# Altium project Bench_PSU_Main_Board.PrjPcb
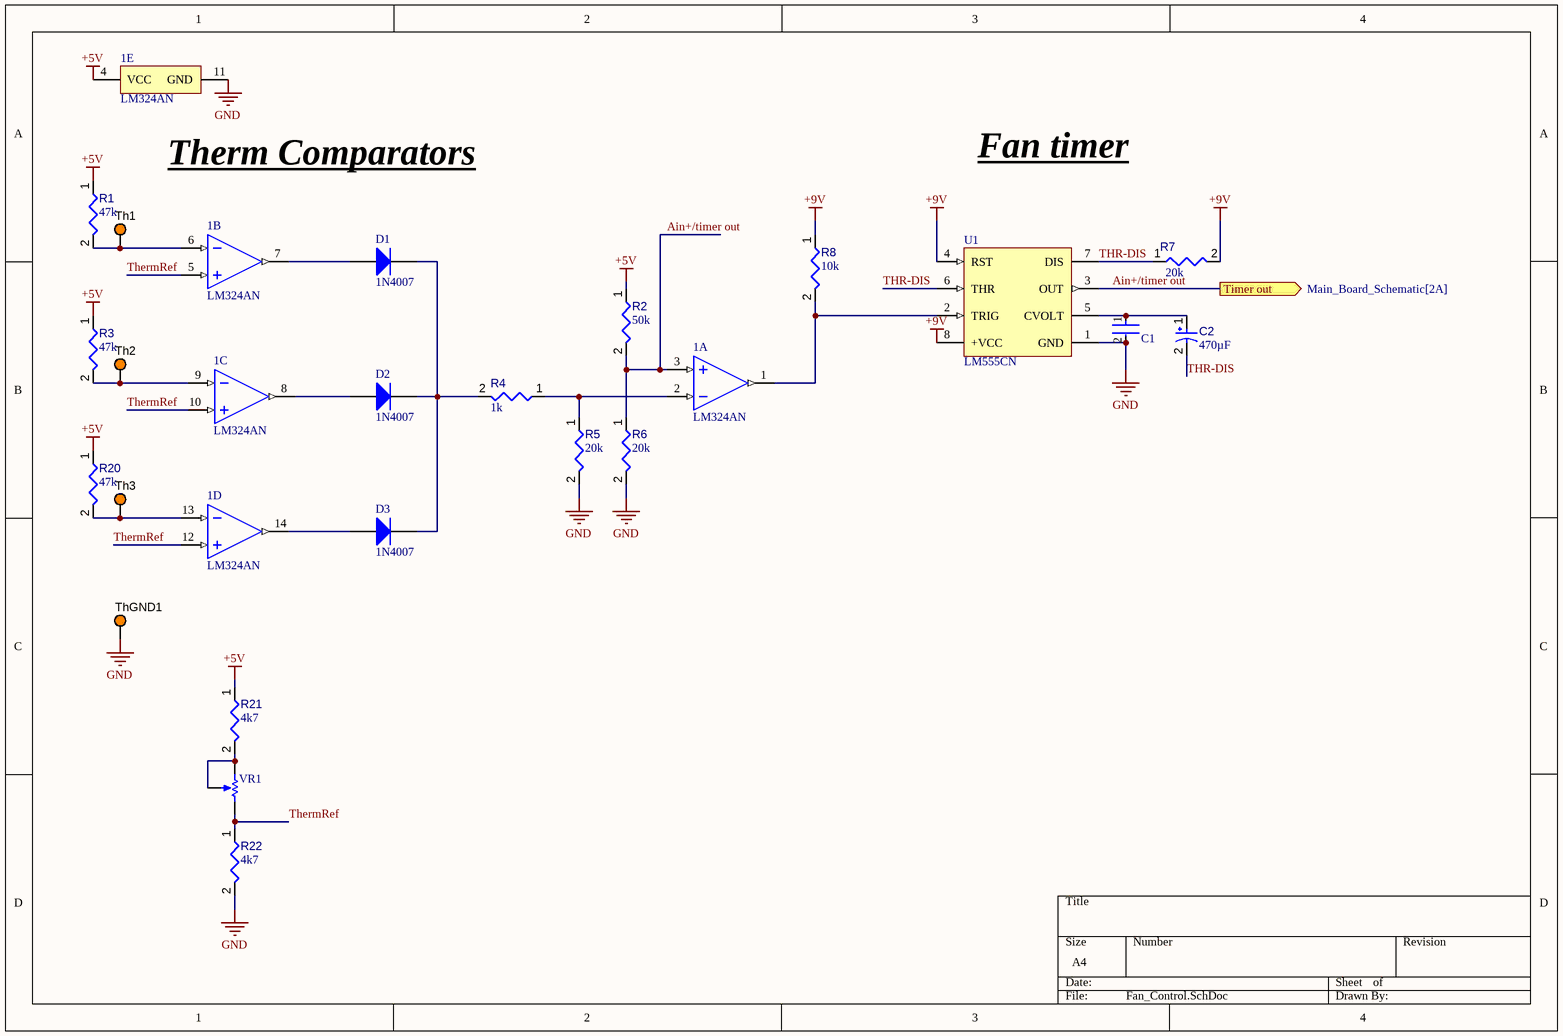
[diagram p0: Fan_Control.SchDoc]
7 sheets, 76 parts. Net scope: hierarchical (ports join the sheet entries above them; power ports are global).
Board files: Control_Board.PcbDoc, Current_Control.PcbDoc, Voltage_Controll.PcbDoc
Sheets:
  Fan_Control.SchDoc
  Relay_Latches.SchDoc
  Relays.SchDoc
  Power_Supply.SchDoc
    U_Voltage_Control = Voltage_Control.SchDoc
    U_Current_Limit = Current_Limit.SchDoc
    U_Power = Power.SchDoc

## Sheet Fan_Control.SchDoc
size A4; SheetNumber: 6; SheetTotal: 7

### Parts
1  LM324AN  [TI-N0014A]  (parts A,B,C,D,E of 5)
C1  RCER71H103K0K1H03B  [FP-RCE0K1-MFG]  (value not drawn)
C2  value 470µF  [CAPPR65-350-1150X800X1250]  (hidden comment: ECA1HM101)
D1  1N4007  [FAIR-DO-41-2]
D2  1N4007  [FAIR-DO-41-2]
D3  1N4007  [FAIR-DO-41-2]
R1  value 47k  [RESA60-630X240]  (hidden comment: MFR-25FBF52-100R)
R2  value 50k  [RESA60-630X240]  (hidden comment: MFR-25FBF52-100R)
R3  value 47k  [RESA60-630X240]  (hidden comment: MFR-25FBF52-100R)
R4  value 1k  [RESA60-630X240]  (hidden comment: MFR-25FBF52-100R)
R5  value 20k  [RESA60-630X240]  (hidden comment: MFR-25FBF52-100R)
R6  value 20k  [RESA60-630X240]  (hidden comment: MFR-25FBF52-100R)
R7  value 20k  [RESA60-630X240]  (hidden comment: MFR-25FBF52-1K)
R8  value 10k  [RESA60-630X240]  (hidden comment: MFR-25FBF52-1K)
R20  value 47k  [RESA60-630X240]  (hidden comment: MFR-25FBF52-100R)
R21  value 4k7  [RESA60-630X240]  (hidden comment: MFR-25FBF52-100R)
R22  value 4k7  [RESA60-630X240]  (hidden comment: MFR-25FBF52-100R)
Th1  5003  [KSTN-5003]  (value not drawn)
Th2  5003  [KSTN-5003]  (value not drawn)
Th3  5003  [KSTN-5003]  (value not drawn)
ThGND1  5003  [KSTN-5003]  (value not drawn)
U1  LM555CN  [N08E]
VR1  3362P-1-104LF  [BOUR-3362P]  (value not drawn)

### Ports
Timer out (out, see Main_Board_Schematic[2A])

### Nets
+5V: 1.4(VCC) R1.1 R2.1 R3.1 R20.1 R21.1
+9V: R7.2 R8.1 U1.4(RST) U1.8(+VCC)
GND: 1.11(GND) C1.2 R5.2 R6.2 R22.2 ThGND1.1 U1.1(GND)
Ain+/timer out: 1.3(1IN+) R2.2 R6.1 U1.3(OUT) ; port Timer out
ThermRef: 1.5(2IN+) 1.10(3IN+) 1.12(4IN+) R22.1 VR1.3(CW)
THR-DIS: C2.2 R7.1 U1.6(THR) U1.7(DIS)
Net1_1: 1.1(1OUT) R8.2 U1.2(TRIG)
Net1_2: 1.2(1IN-) R4.1 R5.1
Net1_6: 1.6(2IN-) R1.2 Th1.1
Net1_7: 1.7(2OUT) D1.2(A)
Net1_8: 1.8(3OUT) D2.2(A)
Net1_9: 1.9(3IN-) R3.2 Th2.1
Net1_13: 1.13(4IN-) R20.2 Th3.1
Net1_14: 1.14(4OUT) D3.2(A)
NetC1_1: C1.1 C2.1 U1.5(CVOLT)
NetD1_1: D1.1(K) D2.1(K) D3.1(K) R4.2
NetR21_2: R21.2 VR1.1(CCW) VR1.2(S)

### Notes on the sheet
- Therm Comparators
- Fan timer

### Library data of the parts
1 = CMP-014-00016-2: Quadruple Operational Amplifier, 1.2 MHz, 0 to 70 degC, 14-Pin PDIP (N), Pb-Free (RoHS), Tube; Manufacturer: Texas Instruments (TI); Max Dual Supply Voltage: 16V; Nominal Dual Supply Voltage: 12V; Nominal Voltage Gain: 100dB; Min Supply Voltage: 1.5V; Unity Gain Bandwidth Product: 1.2MHz; Output Current: 30mA; Nominal Supply Current: 3mA; RoHS Compliant: True; Package Reference: N-14; Min Operating Temperature: 0°C; Case/Package: DIP; Mounting Technology: TH; Package Description: 14-Pin Double In-line Package, Body 19.305 x 6.35 mm, Pitch 2.54 mm; Nominal Supply Voltage: 12V; Package URL: http://www.ti.com/lit/ml/mpdi002c/mpdi002c.pdf; Package Quantity: 25; Datasheet Version: SLOS066W, 03/2015; Manufacturer URL: http://www.ti.com/; Datasheet URL: http://www.ti.com/lit/ds/symlink/lm324a.pdf; Min Dual Supply Voltage: 1.5V; Max Supply Voltage: 16V; Pins: 14; Max Operating Temperature: 70°C
C1 = CMP-06035-044411-1: Cap Ceramic 10nF 50V X7R ±10% Radial 5mm +125°C Automotive Bulk; Lead/Base Style: Formed Leads; Lead Diameter: 0.5mm; Resistor Type: Ceramic; Mount: Through Hole; Capacitance: 10nF; Lead Pitch: 0.197inch; Package Quantity: 500; Dielectric: X7R; Lead Free: Lead Free; Min Operating Temperature: -55°C; Packaging: Bulk; Width: 0.098inch; Length: 0.142inch; Voltage Rating: 50V; Case/Package: Radial; Max Operating Temperature: 125°C; Ratings: AEC-Q200; Height - Seated (Max): 0.138inch; Height: 3.5mm; Termination: Radial; Voltage Rating (DC): 50V; Tolerance: 10%
C2 = CMP-001-00026-7: Aluminum Electrolytic Capacitor, 100 uF, +/- 20%, 50 V, -40 to 85 degC, 2-Pin THD, RoHS, Bulk; Manufacturer: Panasonic; Voltage Rating: 50V; Ripple Current: 250mA; Datasheet URL: https://industrial.panasonic.com/cdbs/www-data/pdf/RDF0000/ABA0000C1218.pdf; Lead Pitch: 3.5mm; Mounting Technology: TH; Package Description: 2-Pin Radial Lead, Dia 8 mm, Height 12.5 mm; Diameter: 8mm; Ripple Current (AC): 250mA; Manufacturer URL: http://www.panasonic.com/; Capacitor Type: Electrolytic; Max Operating Temperature: 85°C; Pins: 2; Min Operating Temperature: -40°C; Tolerance: 20%; Case/Package: Radial; Packaging: Bulk; Package Quantity: 200; Package Reference: CAPPR65-350-1150X800X1250; RoHS Compliant: True; Datasheet Version: Rev. 05, 10/2016
D1-D3 = CMP-004-00007-2: General Purpose Rectifier, 1.1 V, 1.0 A, -55 to 175 degC, 2-Pin DO-41, RoHS, Tape and Reel; Manufacturer: Fairchild; Peak Reverse Current: 5uA; Max Surge Current: 30A; Elements: 1; Forward Voltage: 1.1V; Package Version: Rev. 2, 09/2008; Forward Current: 1A; Package Quantity: 5000; Packaging: TapeandReel; Package URL: http://www.fairchildsemi.com/dwg/DO/DO41A.pdf; Manufacturer URL: https://www.fairchildsemi.com/; Package Reference: DO-41-2; Pins: 2; Min Operating Temperature: -55°C; Datasheet Version: Rev. 1.1.0, 11/2014; Max Operating Temperature: 175°C; RoHS Compliant: True; Case/Package: DO-41-2; Mounting Technology: TH; Package Description: 2-Pin Axial Lead, Dia 2.375 mm, Body Length 4.63 mm; Datasheet URL: https://www.fairchildsemi.com/datasheets/1N/1N4007.pdf
R1-R6 R20-R22 = CMP-009-00046-4: Axial Resistor, 100 Ohm, +/- 1%, 0.25 W, -55 to 155 degC, 2-Pin THD, RoHS, Bulk; Manufacturer: Yageo; Voltage Rating: 250V; Power: 250mW; Packaging: Bulk; Max Operating Temperature: 155°C; Mounting Technology: TH; Datasheet Version: Apr-13; Case/Package: Axial; RoHS Compliant: True; Package Description: 2-Pin Axial Lead, Dia 2.4 mm, Body Length 6.3 mm; Package Quantity: 200; Package Reference: MFR-25; Tolerance: 1%; Composition: CarbonFilm; Datasheet URL: http://www.yageo.com/documents/recent/Yageo%20LR_MFR_2013.pdf; Manufacturer URL: http://www.yageo.com/; Min Operating Temperature: -55°C
R7 R8 = CMP-009-00048-4: Axial Resistor, 1 KOhm, +/- 1%, 250 mW, -55 to 155 degC, 2-Pin THD, RoHS, Bulk; Manufacturer: Yageo; Voltage Rating: 250V; Power: 250mW; Min Operating Temperature: -55°C; Max Operating Temperature: 155°C; Tolerance: 1%; Package Reference: MFR-25; Composition: CarbonFilm; Mounting Technology: TH; Packaging: Bulk; Case/Package: Axial; Datasheet URL: http://www.yageo.com/documents/recent/Yageo%20LR_MFR_2013.pdf; Package Quantity: 200; Manufacturer URL: http://www.yageo.com/; Package Description: 2-Pin Axial Lead, Dia 2.4 mm, Body Length 6.3 mm; Datasheet Version: Apr-13; RoHS Compliant: True
Th1-Th3 ThGND1 = CMP-002-00037-2: Test Point, Orange, Height 4.6 mm, Tail Length 3 mm, 1-Pin THD, RoHS; Manufacturer: Keystone; Colour: Orange; Packaging: Bulk; Package Description: 1-Pin Through Hole Device, Dia 2.54 mm; Pins: 1; Package Reference: 5003; Datasheet Version: Jun-15; Case/Package: 5003; Mounting Technology: TH; Connector Type: TestPoint; Diameter: 2.54mm; Contact Material: Bronze; Datasheet URL: http://keyelco.com/userAssets/file/M65p56.pdf; Manufacturer URL: http://www.keyelco.com/; Package Quantity: 10; Contact Plating: Tin; RoHS Compliant: True
U1 = CMP-0056-00017-2: Timer, 8-pin MDIP; Manufacturer: National Semiconductor; CompType: Analog IC; PackageTopMarking: NSUZXYTTE#*LM*555CN; PowerWise: N; PackageReference: N08E; ComponentLink1Description: LM555 Datasheet; ComponentLink3URL: http://www.national.com/packaging/folders/n08e.html; ComponentLink1URL: http://www.national.com/ds/LM/LM555.pdf; ComponentLink2URL: http://www.national.com/pf/LM/LM555.html; PackageDescription: MDIP, .365 x .250 x .130in, 8 Lead, .100in Pitch; DatasheetVersion: Jul-2006; RevisionNote: Component URLs added; Code_JEDEC: MS-001-BA; PinCount: 8; ComponentLink3Description: N08E Package Page; PackageVersion: revG, May-2006; ComponentLink2Description: LM555 Web Page; RoHS: N
VR1 = CMP-009-00040-2: Square Trimpot(R) Trimming Potentiometer, 100 KOhm, 300 V, -55 to 125 degC, 3-Pin THD, RoHS, Tube; Manufacturer: Bourns; Voltage Rating: 300V; Resistance: 100k; Power: 500mW; Tolerance: 10%; RoHS Compliant: True; Mounting Technology: TH; Datasheet URL: http://www.bourns.com/docs/Product-Datasheets/3362.pdf; Min Operating Temperature: -55°C; Composition: Potentiometer; Package Quantity: 250; Lead Pitch: 2.54mm; Case/Package: 3326P; Package Description: 3-Pin Through Hole Device, Body 6.6 x 6.99 mm, Pitch 2.54 mm; Datasheet Version: May-16; Packaging: Rail/Tube; Package Reference: 3326P; Manufacturer URL: http://www.bourns.com/; Max Operating Temperature: 125°C

## Sheet Relay_Latches.SchDoc
size A3; SheetNumber: 3; SheetTotal: 5
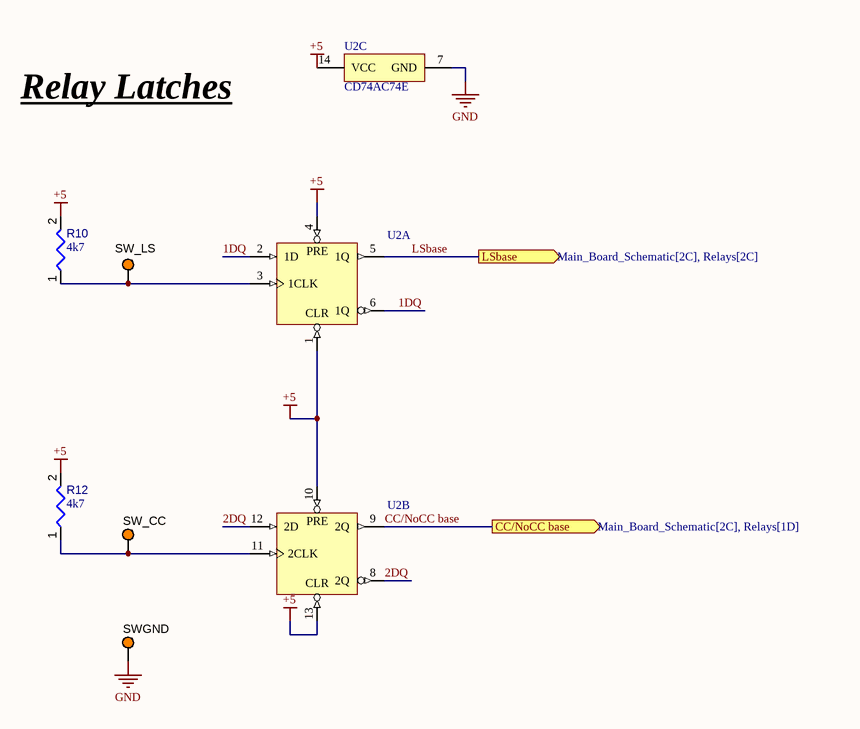
[diagram p1: Relay_Latches.SchDoc]

### Parts
R10  value 4k7  [RESA60-630X240]  (hidden comment: MFR-25FBF52-100R)
R12  value 4k7  [RESA60-630X240]  (hidden comment: MFR-25FBF52-100R)
SW_CC  5003  [KSTN-5003]  (value not drawn)
SW_LS  5003  [KSTN-5003]  (value not drawn)
SWGND  5003  [KSTN-5003]  (value not drawn)
U2  CD74AC74E  [N0014A]  (value not drawn)  (parts A,B,C of 3)

### Ports
CC/NoCC base (out, see Main_Board_Schematic[2C], Relays[1D]), LSbase (out, see Main_Board_Schematic[2C], Relays[2C])

### Nets
+5: R10.2 R12.2 U2.1(1~{CLR}) U2.4(1~{PRE}) U2.10(2~{PRE}) U2.13(2~{CLR}) U2.14(VCC)
GND: SWGND.1 U2.7(GND)
1DQ: U2.2(1D) U2.6(1Q)
2DQ: U2.8(2Q) U2.12(2D)
CC/NoCC base: U2.9(2Q) ; port CC/NoCC base
LSbase: U2.5(1Q) ; port LSbase
NetR10_1: R10.1 SW_LS.1 U2.3(1CLK)
NetR12_1: R12.1 SW_CC.1 U2.11(2CLK)

### Notes on the sheet
- Relay Latches
- (in symbol CMP-1619-00741-2, part A) PRE; CLR
- (in symbol CMP-1619-00741-2, part B) PRE; CLR

### Library data of the parts
R10 R12 = CMP-009-00046-4: as R1 on sheet Fan_Control; Packaging: Bulk; Max Operating Temperature: 155°C; Mounting Technology: TH; Datasheet Version: Apr-13; Case/Package: Axial; RoHS Compliant: True; Package Description: 2-Pin Axial Lead, Dia 2.4 mm, Body Length 6.3 mm; Package Quantity: 200; Package Reference: MFR-25; Tolerance: 1%; Composition: CarbonFilm; Datasheet URL: http://www.yageo.com/documents/recent/Yageo%20LR_MFR_2013.pdf; Manufacturer URL: http://www.yageo.com/; Min Operating Temperature: -55°C
SW_CC SW_LS SWGND = CMP-002-00037-2: as Th1 on sheet Fan_Control; Colour: Orange; Packaging: Bulk; Package Description: 1-Pin Through Hole Device, Dia 2.54 mm; Pins: 1; Package Reference: 5003; Datasheet Version: Jun-15; Case/Package: 5003; Mounting Technology: TH; Connector Type: TestPoint; Diameter: 2.54mm; Contact Material: Bronze; Datasheet URL: http://keyelco.com/userAssets/file/M65p56.pdf; Manufacturer URL: http://www.keyelco.com/; Package Quantity: 10; Contact Plating: Tin; RoHS Compliant: True
U2 = CMP-1619-00741-2: Dual Positive-Edge-Triggered D-Type Flip-Flops with Set and Reset, N0014A, TUBE; Manufacturer: Texas Instruments; VCC(Min)(V): 1.5; Rating: Catalog; Voltage(Nom)(V): 1.5,3.3,5; VCC(Max)(V): 5.5; Technology Family: AC; Input Type: CMOS; ICC @ Nom Voltage(Max)(mA): 0.04; Schmitt Trigger: No; F @ Nom Voltage(Max)(Mhz): 100; Output Drive (IOL/IOH)(Max)(mA): 24/-24; Output Logic: Inverted,Non-inverted; tpd @ Nom Voltage(Max)(ns): 114,12.7,9.1; Bits(#): 2; Generic Part Number: CD74AC74; Operating Temperature Range(C): -55 to 125; Code_JEDEC: MS-001; 3-State Output: No; PackageReference: N0014A; DatasheetVersion: SCHS231D; Output Type: CMOS

## Sheet Relays.SchDoc
size A4; SheetNumber: 6; SheetTotal: 8
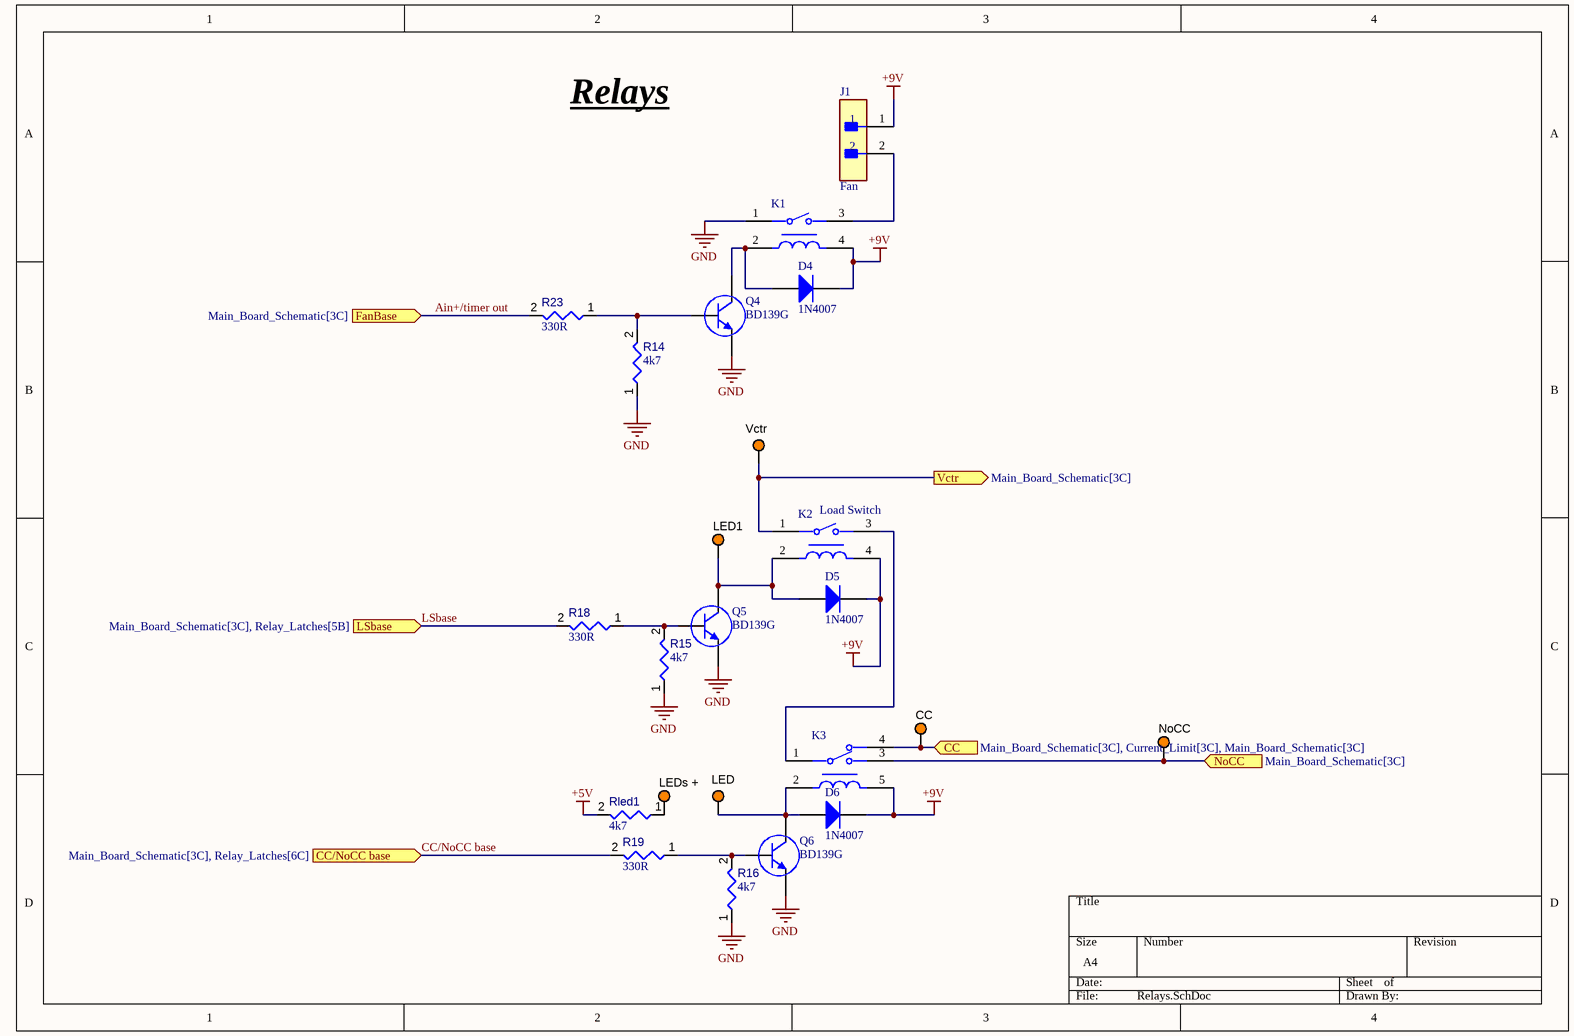
[diagram p2: Relays.SchDoc]

### Parts
CC  5003  [KSTN-5003]  (value not drawn)
D4  1N4007  [FAIR-DO-41-2]
D5  1N4007  [FAIR-DO-41-2]
D6  1N4007  [FAIR-DO-41-2]
J1  Fan  [FP-B2B-XH-A_LF_SN-MFG]
K1  LKQ1AF-5V-TV-5  [FP-LKQ1AF-5V-TV-5-MFG]  (value not drawn)
K2  Load Switch  [FP-LKQ1AF-5V-TV-5-MFG]
K3  G5LE-14-36 DC12  [FP-G5LE-14-36_DC12-MFG]  (value not drawn)
LED  5003  [KSTN-5003]  (value not drawn)
LED1  5003  [KSTN-5003]  (value not drawn)
LEDs_+  5003  [KSTN-5003]  (value not drawn)
NoCC  5003  [KSTN-5003]  (value not drawn)
Q4  BD139G  [FP-77-09-MFG]
Q5  BD139G  [FP-77-09-MFG]
Q6  BD139G  [FP-77-09-MFG]
R14  value 4k7  [RESA60-630X240]  (hidden comment: MFR-25FBF52-100R)
R15  value 4k7  [RESA60-630X240]  (hidden comment: MFR-25FBF52-100R)
R16  value 4k7  [RESA60-630X240]  (hidden comment: MFR-25FBF52-100R)
R18  value 330R  [RESA60-630X240]  (hidden comment: MFR-25FBF52-100R)
R19  value 330R  [RESA60-630X240]  (hidden comment: MFR-25FBF52-100R)
R23  value 330R  [RESA60-630X240]  (hidden comment: MFR-25FBF52-100R)
Rled1  value 4k7  [RESA60-630X240]  (hidden comment: MFR-25FBF52-100R)
Vctr  5003  [KSTN-5003]  (value not drawn)

### Ports
CC (in, see Main_Board_Schematic[3C], Current_Limit[3C], Main_Board_Schematic[3C]), CC/NoCC base (in, see Main_Board_Schematic[3C], Relay_Latches[6C]), FanBase (in, see Main_Board_Schematic[3C]), LSbase (in, see Main_Board_Schematic[3C], Relay_Latches[5B]), NoCC (in, see Main_Board_Schematic[3C]), Vctr (out, see Main_Board_Schematic[3C])

### Nets
+5V: Rled1.2
+9V: D4.1(K) D5.1(K) D6.1(K) J1.1 K1.4 K2.4 K3.5
GND: K1.1 Q4.1(E) Q5.1(E) Q6.1(E) R14.1 R15.1 R16.1
Ain+/timer out: R23.2 ; port FanBase
CC/NoCC base: R19.2 ; port CC/NoCC base
LSbase: R18.2 ; port LSbase
NetCC_1: CC.1 K3.4 ; port CC
NetD4_2: D4.2(A) K1.2 Q4.3(C)
NetD5_2: D5.2(A) K2.2 LED1.1 Q5.3(C)
NetD6_2: D6.2(A) K3.2 LED.1 Q6.3(C)
NetJ1_2: J1.2 K1.3
NetK2_1: K2.1 Vctr.1 ; port Vctr
NetK2_3: K2.3 K3.1
NetK3_3: K3.3 NoCC.1 ; port NoCC
NetLEDs_+_1: LEDs_+.1 Rled1.1
NetQ4_2: Q4.2(B) R14.2 R23.1
NetQ5_2: Q5.2(B) R15.2 R18.1
NetQ6_2: Q6.2(B) R16.2 R19.1

### Notes on the sheet
- Relays

### Library data of the parts
CC LED LED1 LEDs_+ NoCC Vctr = CMP-002-00037-2: as Th1 on sheet Fan_Control; Colour: Orange; Packaging: Bulk; Package Description: 1-Pin Through Hole Device, Dia 2.54 mm; Pins: 1; Package Reference: 5003; Datasheet Version: Jun-15; Case/Package: 5003; Mounting Technology: TH; Connector Type: TestPoint; Diameter: 2.54mm; Contact Material: Bronze; Datasheet URL: http://keyelco.com/userAssets/file/M65p56.pdf; Manufacturer URL: http://www.keyelco.com/; Package Quantity: 10; Contact Plating: Tin; RoHS Compliant: True
D4-D6 = CMP-004-00007-2: as D1 on sheet Fan_Control; Package Quantity: 5000; Packaging: TapeandReel; Package URL: http://www.fairchildsemi.com/dwg/DO/DO41A.pdf; Manufacturer URL: https://www.fairchildsemi.com/; Package Reference: DO-41-2; Pins: 2; Min Operating Temperature: -55°C; Datasheet Version: Rev. 1.1.0, 11/2014; Max Operating Temperature: 175°C; RoHS Compliant: True; Case/Package: DO-41-2; Mounting Technology: TH; Package Description: 2-Pin Axial Lead, Dia 2.375 mm, Body Length 4.63 mm; Datasheet URL: https://www.fairchildsemi.com/datasheets/1N/1N4007.pdf
J1 = CMP-2000-05888-3: CONN HEADER VERT 2POS 2.5MM; Current Rating: 3A; Voltage Rating: 250V; Number of Contacts: 2; Contact Resistance: 20mR; Wire/Cable Gauge: 22AWG; Insulation Resistance: 1GR; Connector Type: Male Pin; Packaging: Bulk; Contact Material: Brass; Lead Free: Lead Free; Orientation: Straight; Contact Plating: Tin; Max Current Rating: 3A; Termination: Solder; Fastening Type: Detent; Depth: 5.75mm; Housing Material: Polyamide; REACH SVHC: No SVHC; Series: XH; Voltage Rating (AC): 250V; Number of Positions: 2; Color: Natural; Contact Type: Male Pin; Max Voltage Rating (DC): 250V; Pitch: 2.5mm; Lead Pitch: 2.5mm; Mount: Through Hole; Max Operating Temperature: 85°C; Length: 7.4mm; Max Voltage Rating (AC): 250V; Min Operating Temperature: -25°C; Number of Rows: 1; Housing Color: White
K1 K2 = CMP-008-00006-1: Quiet Type, High Sensitivity 250MW, Slim Power Relay
K3 = CMP-08822-000072-1: RELAY GEN PURPOSE SPDT 10A 12V; Coil Resistance: 400R; Release Time: 5ms; Max Voltage Rating (DC): 125V; Coil Current: 30mA; Coil Power: 360mW; Relay Type: General Purpose; Coil Type: Non-Latching; Max Voltage Rating (AC): 250V; Operate Time: 10ms; Package Quantity: 100; Number of Pins: 5; Mount: Through Hole; Termination: PC Pin; Series: G5LE; Min Operating Temperature: -25°C; Max Operating Temperature: 85°C; Throw Configuration: SPDT; Coil Voltage (DC): 12V; Radiation Hardening: No; Contact Current Rating: 10A; Packaging: Tray; Contact Material: Tin
Q4-Q6 = CMP-013-00034-1: 1.5 A, 80 V NPN Power Bipolar Junction Transistor. ONSSPCTRNSTLT1T0R;; Case/Package: TO-225; Max Operating Temperature: 150°C; Pins: 3; Min Operating Temperature: -55°C
R14-R16 R18 R19 R23 Rled1 = CMP-009-00046-4: as R1 on sheet Fan_Control; Packaging: Bulk; Max Operating Temperature: 155°C; Mounting Technology: TH; Datasheet Version: Apr-13; Case/Package: Axial; RoHS Compliant: True; Package Description: 2-Pin Axial Lead, Dia 2.4 mm, Body Length 6.3 mm; Package Quantity: 200; Package Reference: MFR-25; Tolerance: 1%; Composition: CarbonFilm; Datasheet URL: http://www.yageo.com/documents/recent/Yageo%20LR_MFR_2013.pdf; Manufacturer URL: http://www.yageo.com/; Min Operating Temperature: -55°C

## Sheet Power_Supply.SchDoc
size A4; SheetNumber: 1; SheetTotal: 8
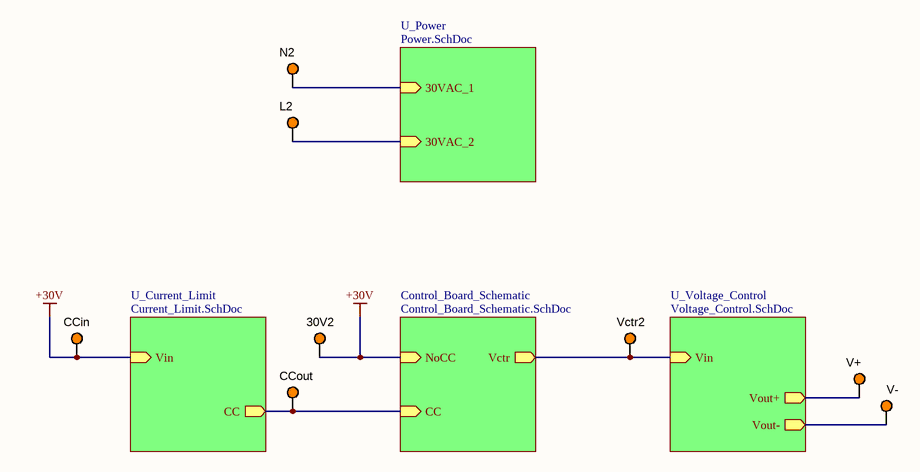
[diagram p3: Power_Supply.SchDoc]

### Parts
30V2  5003  [KSTN-5003]  (value not drawn)
CCin  5003  [KSTN-5003]  (value not drawn)
CCout  5003  [KSTN-5003]  (value not drawn)
L2  5003  [KSTN-5003]  (value not drawn)
N2  5003  [KSTN-5003]  (value not drawn)
V+  5003  [KSTN-5003]  (value not drawn)
V-  5003  [KSTN-5003]  (value not drawn)
Vctr2  5003  [KSTN-5003]  (value not drawn)

### Sub-sheets
Control_Board_Schematic = Control_Board_Schematic.SchDoc (file not in this document): Vctr (out), NoCC (in), CC (in)
U_Current_Limit = Current_Limit.SchDoc: Vin (in), CC (out)
U_Power = Power.SchDoc: 30VAC_1 (in), 30VAC_2 (in)
U_Voltage_Control = Voltage_Control.SchDoc: Vin (in), Vout+ (out), Vout- (out)

### Nets
+30V: 30V2.1 CCin.1 ; sheet Control_Board_Schematic/NoCC, sheet U_Current_Limit/Vin
Net*1_2: L2.1 ; sheet U_Power/30VAC_2
Net*1_3: N2.1 ; sheet U_Power/30VAC_1
NetCCout_1: CCout.1 ; sheet Control_Board_Schematic/CC, sheet U_Current_Limit/CC
NetD7_1: V+.1 ; sheet U_Voltage_Control/Vout+
NetD7_2: V-.1 ; sheet U_Voltage_Control/Vout-
NetU4_3: Vctr2.1 ; sheet Control_Board_Schematic/Vctr, sheet U_Voltage_Control/Vin

### Library data of the parts
30V2 CCin CCout L2 N2 V+ V- Vctr2 = CMP-002-00037-2: as Th1 on sheet Fan_Control; Colour: Orange; Packaging: Bulk; Package Description: 1-Pin Through Hole Device, Dia 2.54 mm; Pins: 1; Package Reference: 5003; Datasheet Version: Jun-15; Case/Package: 5003; Mounting Technology: TH; Connector Type: TestPoint; Diameter: 2.54mm; Contact Material: Bronze; Datasheet URL: http://keyelco.com/userAssets/file/M65p56.pdf; Manufacturer URL: http://www.keyelco.com/; Package Quantity: 10; Contact Plating: Tin; RoHS Compliant: True

## Sheet Voltage_Control.SchDoc
size A4; SheetNumber: 8; SheetTotal: 8
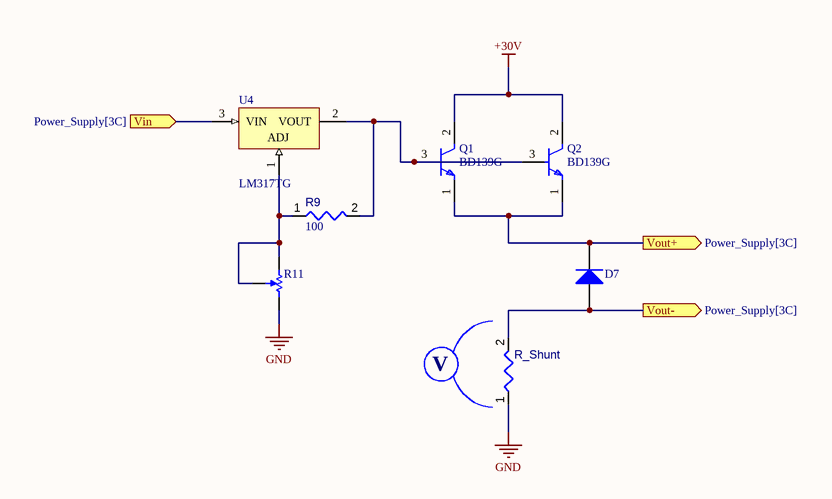
[diagram p4: Voltage_Control.SchDoc]

### Parts
D7  1N4007  [FAIR-DO-41-2]  (value not drawn)
Q1  BD139G  [FP-77-09-MFG]
Q2  BD139G  [FP-77-09-MFG]
R9  value 100  [RESA60-630X240]  (hidden comment: MFR-25FBF52-100R)
R11  3296W-1-102LF  [BOUR-3296W-1-3]  (value not drawn)
R_Shunt  MFR-25FBF52-100R  [RESA60-630X240]  (value not drawn)
U4  LM317TG  [ONSC-TO-220-3-221AB-01]

### Ports
Vin (in, see Power_Supply[3C]), Vout+ (out, see Power_Supply[3C]), Vout- (out, see Power_Supply[3C])

### Nets
+30V: Q1.2(C) Q2.2(C)
GND: R11.2(B) R_Shunt.1
NetD7_1: D7.1(K) Q1.1(E) Q2.1(E) ; port Vout+
NetD7_2: D7.2(A) R_Shunt.2 ; port Vout-
NetQ1_3: Q1.3(B) Q2.3(B) R9.2 U4.2(VOUT)
NetR9_1: R9.1 R11.1(A) R11.3(TAP) U4.1(ADJ)
NetU4_3: U4.3(VIN) ; port Vin

### Notes on the sheet
- V

### Library data of the parts
D7 = CMP-004-00007-2: as D1 on sheet Fan_Control; Package Quantity: 5000; Packaging: TapeandReel; Package URL: http://www.fairchildsemi.com/dwg/DO/DO41A.pdf; Manufacturer URL: https://www.fairchildsemi.com/; Package Reference: DO-41-2; Pins: 2; Min Operating Temperature: -55°C; Datasheet Version: Rev. 1.1.0, 11/2014; Max Operating Temperature: 175°C; RoHS Compliant: True; Case/Package: DO-41-2; Mounting Technology: TH; Package Description: 2-Pin Axial Lead, Dia 2.375 mm, Body Length 4.63 mm; Datasheet URL: https://www.fairchildsemi.com/datasheets/1N/1N4007.pdf
Q1 Q2 = CMP-013-00035-1: 1.5 A, 80 V NPN Power Bipolar Junction Transistor. ONSSPCTRNSTLT1T0R;; Pins: 3; Max Operating Temperature: 150°C; Case/Package: TO-225; Min Operating Temperature: -55°C; Mounting Technology: Through Hole
R9 = CMP-009-00046-5: Axial Resistor, 100 Ohm, +/- 1%, 0.25 W, -55 to 155 degC, 2-Pin THD, RoHS, Bulk; Manufacturer: Yageo; Power: 250mW; Voltage Rating: 250V; Tolerance: 1%; Packaging: Bulk; Max Operating Temperature: 155°C; Package Reference: MFR-25; Case/Package: Axial; Package Description: 2-Pin Axial Lead, Dia 2.4 mm, Body Length 6.3 mm; RoHS Compliant: True; Composition: CarbonFilm; Datasheet URL: http://www.yageo.com/documents/recent/Yageo%20LR_MFR_2013.pdf; Min Operating Temperature: -55°C; Package Quantity: 200; Mounting Technology: TH; Datasheet Version: Apr-13; Manufacturer URL: http://www.yageo.com/
R11 = CMP-009-00037-2: Square Trimpot(R) Trimming Potentiometer, 1000 Ohm, -55 to 125 degC, 3-Pin THD, RoHS, Tube; Manufacturer: Bourns; Power: 500mW; Tolerance: 10%; Voltage Rating: 300V; Resistance: 1k; Datasheet Version: May-16; Min Operating Temperature: -55°C; Max Operating Temperature: 150°C; Composition: Potentiometer; Package Description: 3-Pin Through Hole Device, Body 9.53 x 4.83 mm, Pitch 2.54 mm; Manufacturer URL: http://www.bourns.com/; Package Reference: 3296W-1-3; RoHS Compliant: True; Case/Package: 3296W-1-3; Packaging: Rail/Tube; Mounting Technology: TH; Package Quantity: 50; Datasheet URL: http://www.bourns.com/docs/Product-Datasheets/3296.pdf
R_Shunt = CMP-009-00046-5: Axial Resistor, 100 Ohm, +/- 1%, 0.25 W, -55 to 155 degC, 2-Pin THD, RoHS, Bulk; Manufacturer: Yageo; Power: 250mW; Voltage Rating: 250V; Value: 0.1; Tolerance: 1%; Packaging: Bulk; Max Operating Temperature: 155°C; Package Reference: MFR-25; Case/Package: Axial; Package Description: 2-Pin Axial Lead, Dia 2.4 mm, Body Length 6.3 mm; RoHS Compliant: True; Composition: CarbonFilm; Datasheet URL: http://www.yageo.com/documents/recent/Yageo%20LR_MFR_2013.pdf; Min Operating Temperature: -55°C; Package Quantity: 200; Mounting Technology: TH; Datasheet Version: Apr-13; Manufacturer URL: http://www.yageo.com/
U4 = CMP-019-00023-3: Adjustable Output, Positive Voltage Regulator, 1.5 A, 0 to 125 degC, 3-Pin TO-220 (221AB-01), Pb-Free, Rail; Manufacturer: ON Semiconductor; Outputs: 1; Max Input Voltage: 40V; Min Input Voltage: 4.2V; Output Current: 1.5A; Output Voltage: 1.2V; Package Version: Rev. A, 11/2010; Mounting Technology: TH; Case/Package: TO-220; Package Description: 3-Pin Flange Mount, Vertical Straight Lead, Body 9.97 x 4.445 mm, Pitch 2.54 mm; Package Reference: TO-220-3-221AB-01; Manufacturer URL: http://www.onsemi.com/; Package Quantity: 50; Datasheet Version: Rev. 14, 01/2016; Max Ouput Current: 1.5A; Min Operating Temperature: 0°C; Packaging: Rail/Tube; Datasheet URL: http://www.onsemi.com/pub_link/Collateral/LM317-D.PDF; Max Operating Temperature: 125°C; RoHS Compliant: True; Pins: 3

## Sheet Current_Limit.SchDoc
size A4; SheetNumber: 7; SheetTotal: 8
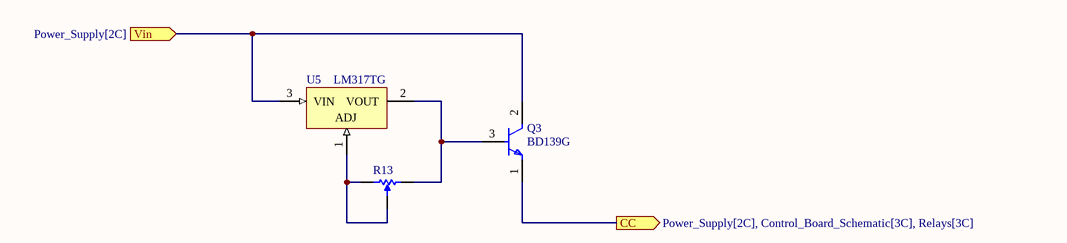
[diagram p5: Current_Limit.SchDoc]

### Parts
Q3  BD139G  [FP-77-09-MFG]
R13  3296W-1-102LF  [BOUR-3296W-1-3]  (value not drawn)
U5  LM317TG  [ONSC-TO-220-3-221AB-01]

### Ports
CC (out, see Power_Supply[2C], Control_Board_Schematic[3C], Relays[3C]), Vin (in, see Power_Supply[2C])

### Nets
+30V: Q3.2(C) U5.3(VIN) ; port Vin
NetCCout_1: Q3.1(E) ; port CC
NetQ3_3: Q3.3(B) R13.2(B) U5.2(VOUT)
NetR13_1: R13.1(A) R13.3(TAP) U5.1(ADJ)

### Library data of the parts
Q3 = CMP-013-00035-1: as Q1 on sheet Voltage_Control; Pins: 3; Max Operating Temperature: 150°C; Case/Package: TO-225; Min Operating Temperature: -55°C; Mounting Technology: Through Hole
R13 = CMP-009-00037-2: as R11 on sheet Voltage_Control; Datasheet Version: May-16; Min Operating Temperature: -55°C; Max Operating Temperature: 150°C; Composition: Potentiometer; Package Description: 3-Pin Through Hole Device, Body 9.53 x 4.83 mm, Pitch 2.54 mm; Manufacturer URL: http://www.bourns.com/; Package Reference: 3296W-1-3; RoHS Compliant: True; Case/Package: 3296W-1-3; Packaging: Rail/Tube; Mounting Technology: TH; Package Quantity: 50; Datasheet URL: http://www.bourns.com/docs/Product-Datasheets/3296.pdf
U5 = CMP-019-00023-3: as U4 on sheet Voltage_Control; Mounting Technology: TH; Case/Package: TO-220; Package Description: 3-Pin Flange Mount, Vertical Straight Lead, Body 9.97 x 4.445 mm, Pitch 2.54 mm; Package Reference: TO-220-3-221AB-01; Manufacturer URL: http://www.onsemi.com/; Package Quantity: 50; Datasheet Version: Rev. 14, 01/2016; Max Ouput Current: 1.5A; Min Operating Temperature: 0°C; Packaging: Rail/Tube; Datasheet URL: http://www.onsemi.com/pub_link/Collateral/LM317-D.PDF; Max Operating Temperature: 125°C; RoHS Compliant: True; Pins: 3

## Sheet Power.SchDoc
size A4; SheetNumber: 2; SheetTotal: 8
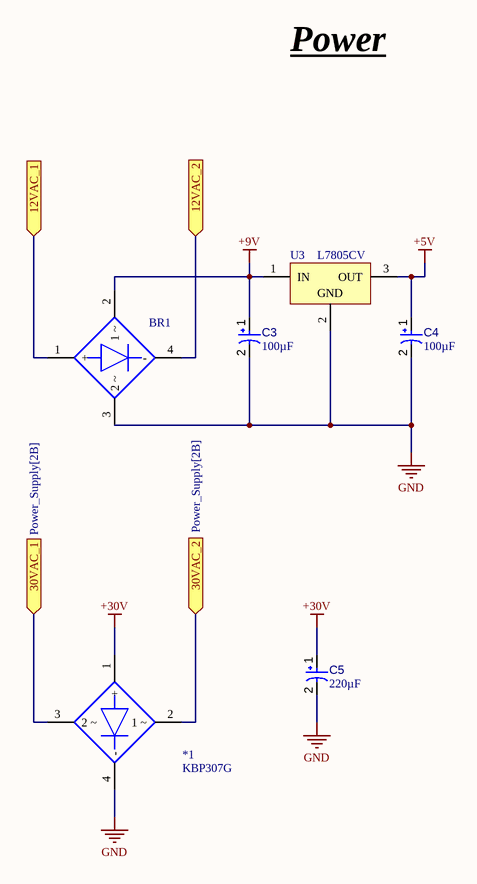
[diagram p6: Power.SchDoc]

### Parts
*1  KBP307G  [KBP4]
BR1  GBU8D  [FP-127EL-MFG]  (value not drawn)
C3  value 100µF  [CAPPR55-250-1120X630X1220]  (hidden comment: ECA-2AM220)
C4  value 100µF  [CAPPR55-250-1120X630X1220]  (hidden comment: ECA-2AM220)
C5  value 220µF  [CAPPR65-500-1250X1000X1350]  (hidden comment: ECA-1HM221)
U3  L7805CV  [TO220]

### Ports
12VAC_1 (in), 12VAC_2 (in), 30VAC_1 (in, see Power_Supply[2B]), 30VAC_2 (in, see Power_Supply[2B])

### Nets
+5V: C4.1 U3.3(OUT)
+9V: BR1.2(1_~) C3.1 U3.1(IN)
+30V: *1.1(+) C5.1
GND: *1.4(-) BR1.3(2_~) C3.2 C4.2 C5.2 U3.2(GND)
Net*1_2: *1.2(1_~) ; port 30VAC_2
Net*1_3: *1.3(2_~) ; port 30VAC_1
NetBR1_1: BR1.1(+) ; port 12VAC_1
NetBR1_4: BR1.4(-) ; port 12VAC_2

### Notes on the sheet
- Power

### Library data of the parts
*1 = CMP-019-00050-1: 3A, 1000V, Standard Bridge Rectifier; Max Operating Temperature: 150°C; Mounting Technology: Through Hole; Pins: 4; Min Operating Temperature: -55°C
BR1 = CMP-00278-84328822-1: GBU8D Diode Rectifier Bridge Single 200V 8A 4-Pin Case GBU Rail; Manufacturer Lifecycle Status: ACTIVE; Peak Reverse Current: 5µA; Max Forward Surge Current (Ifsm): 200A; Max Reverse Leakage Current: 50µA; Forward Voltage: 1V; Max Junction Temperature (Tj): 150°C; Number of Elements: 1; Power Dissipation: 16W; Element Configuration: Single; Radiation Hardening: No; Lifecycle Status: Production; Min Operating Temperature: -55°C; Height: 18.8mm; NexarPartId: 84328822; Mount: Through Hole; Width: 3.56mm; RoHS: Compliant; Average Rectified Current: 8A; Length: 22.3mm; Lead Free: Lead Free; Forward Current: 8A; Output Current: 8A; Max Operating Temperature: 150°C; Number of Pins: 4; Max Repetitive Reverse Voltage (Vrrm): 200V; Voltage Rating (DC): 200V; Weight: 5.4g; Contact Plating: Tin; Max Surge Current: 200A; Schedule B: 8541100080; Current Rating: 8A; REACH SVHC: No SVHC; Case/Package: SIP; Peak Non-Repetitive Surge Current: 200A; Reverse Voltage: 200V
C3 C4 = CMP-001-00035-7: Aluminum Electrolytic Capacitor, 22 uF, +/- 20%, 100 V, -40 to 85 degC, 2-Pin THD, RoHS, Bulk; Manufacturer: Panasonic; Voltage Rating: 100V; Ripple Current: 115mA; Manufacturer URL: http://www.panasonic.com/; Packaging: Bulk; Package Description: 2-Pin Radial Lead, Dia 6.3 mm, Height 12.2 mm; Datasheet URL: https://industrial.panasonic.com/cdbs/www-data/pdf/RDF0000/ABA0000C1047.pdf; RoHS Compliant: True; Package Quantity: 200; Case/Package: Radial; Package Reference: CAPPR55-250-1120X630X1220; Datasheet Version: Mar-16; Pins: 2; Tolerance: 20%; Diameter: 6.3mm; Max Operating Temperature: 85°C; Ripple Current (AC): 115mA; Capacitor Type: Electrolytic; Mounting Technology: TH; Min Operating Temperature: -40°C; Lead Pitch: 2.5mm
C5 = CMP-001-00028-7: Aluminum Electrolytic Capacitor, 220 uF, +/- 20%, 50 V, -40 to 85 degC, 2-Pin THD, RoHS, Bulk; Manufacturer: Panasonic; Ripple Current (AC): 400mA; Voltage Rating: 50V; Case/Package: Radial; Packaging: Bulk; Package Quantity: 200; Min Operating Temperature: -40°C; Datasheet Version: Mar-16; Package Reference: CAPPR65-500-1250X1000X1350; Mounting Technology: TH; Ripple Current: 400mA; Pins: 2; Package Description: 2-Pin Radial Lead, Dia 10 mm, Body Length 12.5 mm; RoHS Compliant: True; Max Operating Temperature: 85°C; Lead Pitch: 5mm; Tolerance: 20%; Manufacturer URL: http://www.panasonic.com/; Diameter: 10mm; Capacitor Type: Electrolytic; Datasheet URL: http://industrial.panasonic.com/cdbs/www-data/pdf/RDF0000/DMF0000COL68.pdf
U3 = CMP-0244-00483-1: Positive Voltage Regulator, 5V, 3-Pin TO-220; PackageDescription: TO, Thru-Hole, Vertical, Heatsink Mounted; 3 In-Line Leads; Pitch 2.54 mm; ComponentLink2Description: Datasheet; PackageReference: TO220; ComponentLink3URL: http://www.st.com/internet/com/TECHNICAL_RESOURCES/TECHNICAL_LITERATURE/PACKAGE_INFORMATION/CD00004649.pdf; DatasheetVersion: 16/11/2011; ComponentLink1Description: Manufacturer URL; ComponentLink1URL: http://www.st.com; PackageVersion: ver3.0; ComponentLink3Description: Package Specification; ComponentLink2URL: http://www.st.com/internet/com/TECHNICAL_RESOURCES/TECHNICAL_LITERATURE/DATASHEET/CD00000444.pdf

## Nets that join several sheets
+5V: Fan_Control (6 pins), Relays (Rled1.2), Power (C4.1 U3.3)
+9V: Fan_Control (R7.2 R8.1 U1.4 U1.8), Relays (7 pins), Power (BR1.2 C3.1 U3.1)
+30V: Power_Supply (30V2.1 CCin.1), Voltage_Control (Q1.2 Q2.2), Current_Limit (Q3.2 U5.3), Power (*1.1 C5.1)
GND: Fan_Control (7 pins), Relay_Latches (SWGND.1 U2.7), Relays (7 pins), Voltage_Control (R11.2 R_Shunt.1), Power (6 pins)
Net*1_2: Power_Supply (L2.1), Power (*1.2)
Net*1_3: Power_Supply (N2.1), Power (*1.3)
NetCCout_1: Power_Supply (CCout.1), Current_Limit (Q3.1)
NetD7_1: Power_Supply (V+.1), Voltage_Control (D7.1 Q1.1 Q2.1)
NetD7_2: Power_Supply (V-.1), Voltage_Control (D7.2 R_Shunt.2)
NetU4_3: Power_Supply (Vctr2.1), Voltage_Control (U4.3)